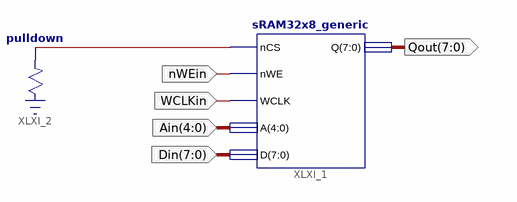
[diagram p0: schematic sheet 1]
// Xilinx ISE schematic DataMemory.sch (spartan3e) as structural Verilog: 2 symbols, 5 ports
module DataMemory (
  input  nWEin,
  input  WCLKin,
  input  [4:0] Ain,
  input  [7:0] Din,
  output [7:0] Qout
);

  wire XLXN_1;

  sRAM32x8_generic XLXI_1 (.nCS(XLXN_1), .nWE(nWEin), .WCLK(WCLKin), .A(Ain), .D(Din), .Q(Qout));
  \pulldown  XLXI_2 (.O(XLXN_1));
endmodule
